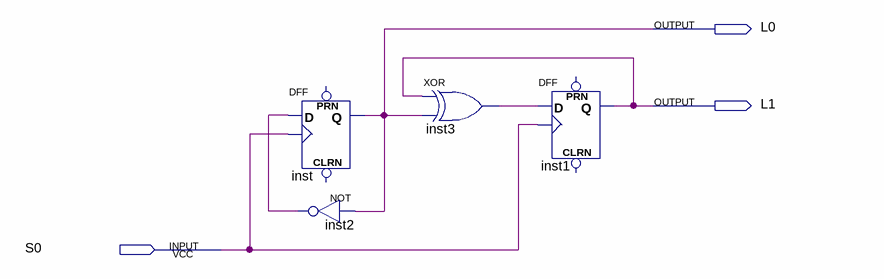
[diagram p0: schematic sheet]
// Quartus schematic exercise1.bdf as structural Verilog: 4 symbols, 3 pins
module exercise1 (
  input  S0,
  output L0,
  output L1
);

  wire inst2_out, inst3_out;

  DFF inst (.CLK(S0), .D(inst2_out), .Q(L0));  // open: CLRN, PRN
  not inst2 (inst2_out, L0);
  xor inst3 (inst3_out, L1, L0);
  DFF inst1 (.CLK(S0), .D(inst3_out), .Q(L1));  // open: CLRN, PRN
endmodule
